# Altium project CALTRANS Signal Interface.PrjPcb
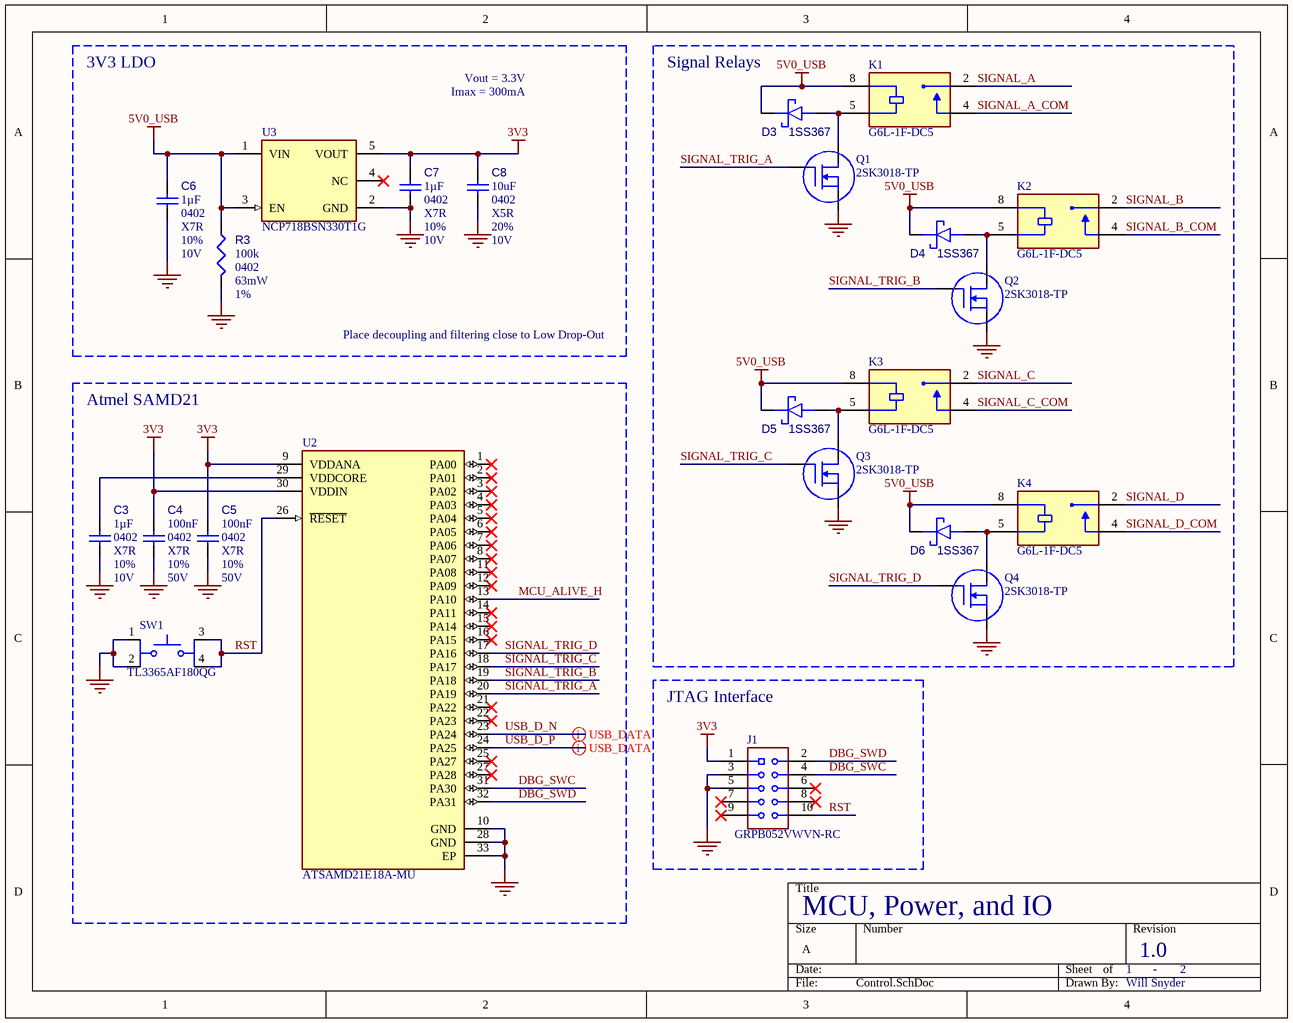
[diagram p0: Control.SchDoc]
2 sheets, 36 parts. Net scope: global (net labels, ports and power ports of the same name join across sheets).
Board file: CALTRANS Signal Interface.PcbDoc
Sheets:
  Control.SchDoc
  USB and LEDs.SchDoc

## Sheet Control.SchDoc
size A; Engineer: Will Snyder; Revision: 1.0; SheetNumber: 1; SheetTotal: 2; DocumentTItle: MCU, Power, and IO

### Parts
C3  value 1µF  Case/Package: 0402  Voltage Rating: 10V  Capacitor Type: X7R  Tolerance: 10%  [CAPC1005X55X30NL05T10]  (hidden comment: GRM155Z71A105KE01D)
C4  value 100nF  Voltage Rating: 50V  Capacitor Type: X7R  Case/Package: 0402  Tolerance: 10%  [CAPC1005X55X30NL05T10]  (hidden comment: 04025C104KAT4A)
C5  value 100nF  Voltage Rating: 50V  Capacitor Type: X7R  Case/Package: 0402  Tolerance: 10%  [CAPC1005X55X30NL05T10]  (hidden comment: 04025C104KAT4A)
C6  value 1µF  Case/Package: 0402  Voltage Rating: 10V  Capacitor Type: X7R  Tolerance: 10%  [CAPC1005X55X30NL05T10]  (hidden comment: GRM155Z71A105KE01D)
C7  value 1µF  Case/Package: 0402  Voltage Rating: 10V  Capacitor Type: X7R  Tolerance: 10%  [CAPC1005X55X30NL05T10]  (hidden comment: GRM155Z71A105KE01D)
C8  value 10uF  Capacitor Type: X5R  Voltage Rating: 10V  Tolerance: 20%  Case/Package: 0402  [CAPC1005X55X30NL05T10]  (hidden comment: GRM155R61A106ME11J)
D3  1SS367  [SOD2513X114N]
D4  1SS367  [SOD2513X114N]
D5  1SS367  [SOD2513X114N]
D6  1SS367  [SOD2513X114N]
J1  GRPB052VWVN-RC  [SULLINS_GRPB052VWVN-RC]
K1  G6L-1F-DC5  [RELAY_G6L-1F-DC5]
K2  G6L-1F-DC5  [RELAY_G6L-1F-DC5]
K3  G6L-1F-DC5  [RELAY_G6L-1F-DC5]
K4  G6L-1F-DC5  [RELAY_G6L-1F-DC5]
Q1  2SK3018-TP  [2SK3018-TP-Footprint-1]
Q2  2SK3018-TP  [2SK3018-TP-Footprint-1]
Q3  2SK3018-TP  [2SK3018-TP-Footprint-1]
Q4  2SK3018-TP  [2SK3018-TP-Footprint-1]
R3  value 100k  Power: 63mW  Case/Package: 0402  Tolerance: 1%  [RESC0402(1005)_L]  (hidden comment: 100KR2F)
SW1  TL3365AF180QG  [SW_TL3365AF180QG]
U2  ATSAMD21E18A-MU  [FP-PG-IPC_A]
U3  NCP718BSN330T1G  [SOT95P280X100-5N]

### Blocks framed on the sheet
3V3 LDO: C6-C8 R3 U3
Signal Relays: D3-D6 K1-K4 Q1-Q4
Atmel SAMD21: C3-C5 SW1 U2
JTAG Interface: J1

### Nets
3V3: C4.1 C5.1 C7.1 C8.1 J1.1 U2.9(VDDANA) U2.30(VDDIN) U3.5(VOUT)
5V0_USB: C6.1 D3.1(K) D4.1(K) D5.1(K) D6.1(K) K1.8(COIL1) K2.8(COIL1) K3.8(COIL1) K4.8(COIL1) R3.1 U3.1(VIN) U3.3(EN)
GND: C3.2 C4.2 C5.2 C6.2 C7.2 C8.2 J1.3 J1.5 Q1.2(S) Q2.2(S) Q3.2(S) Q4.2(S) R3.2 SW1.1 SW1.2 U2.10(GND) U2.28(GND) U2.33(EP) U3.2(GND)
DBG_SWC: J1.4 U2.31(PA30)
DBG_SWD: J1.2 U2.32(PA31)
MCU_ALIVE_H: U2.13(PA10)
RST: J1.10 SW1.3 SW1.4 U2.26(~{RESET})
SIGNAL_A: K1.2(COM)
SIGNAL_A_COM: K1.4(NO)
SIGNAL_B: K2.2(COM)
SIGNAL_B_COM: K2.4(NO)
SIGNAL_C: K3.2(COM)
SIGNAL_C_COM: K3.4(NO)
SIGNAL_D: K4.2(COM)
SIGNAL_D_COM: K4.4(NO)
SIGNAL_TRIG_A: Q1.1(G) U2.20(PA19)
SIGNAL_TRIG_B: Q2.1(G) U2.19(PA18)
SIGNAL_TRIG_C: Q3.1(G) U2.18(PA17)
SIGNAL_TRIG_D: Q4.1(G) U2.17(PA16)
USB_D_N: U2.23(PA24)
USB_D_P: U2.24(PA25)
NetC3_1: C3.1 U2.29(VDDCORE)
NetD3_2: D3.2(A) K1.5(COIL2) Q1.3(D)
NetD4_2: D4.2(A) K2.5(COIL2) Q2.3(D)
NetD5_2: D5.2(A) K3.5(COIL2) Q3.3(D)
NetD6_2: D6.2(A) K4.5(COIL2) Q4.3(D)

Not connected (* = marked no-connect by the designer): J1 6* 7* 8* 9*; U2 1(PA00)* 2(PA01)* 3(PA02)* 4(PA03)* 5(PA04)* 6(PA05)* 7(PA06)* 8(PA07)* 11(PA08)* 12(PA09)* 14(PA11)* 15(PA14)* 16(PA15)* 21(PA22)* 22(PA23)* 25(PA27)* 27(PA28)*; U3 4(NC)*

### Layout directives
differential pair: USB_D_N, USB_D_P

### Notes on the sheet
- Imax = 300mA
- Vout = 3.3V
- Place decoupling and filtering close to Low Drop-Out
- -

### Library data of the parts
C3 C6 C7 = CMP-001-00092-1: Ceramic Capacitor, Multilayer, Ceramic, 10V, 10% +Tol, 10% -Tol, X7R, 15% TC, 1uF, Surface Mount, 0402; Mounting Technology: Surface Mount; Max Operating Temperature: 125°C; Pins: 2; RoHS Compliant: Yes; Min Operating Temperature: -55°C
C4 C5 = CMP-001-00090-1: Ceramic Capacitor, Multilayer, Ceramic, 50V, 10% +Tol, 10% -Tol, X7R, 15% TC, 0.1uF, Surface Mount, 0402; Pins: 2; RoHS Compliant: Yes
C8 = CMP-001-00091-1: Ceramic Capacitor, Multilayer, Ceramic, 10V, 20% +Tol, 20% -Tol, X5R, 15% TC, 10uF, Surface Mount, 0402
D3-D6 = CMP-004-00052-1: Diode Schottky 10V 100mA USC; Forward Voltage: 500mV; Max Operating Temperature: 100°C; Min Operating Temperature: -40°C
J1 = CMP-002-00094-2: Connector Header Through Hole 10 position 0.050 (1.27mm); MF: Sullins; Price: None; Case/Package: None; SnapEDA_Link: https://www.snapeda.com/parts/GRPB052VWVN-RC/Sullins+Connector+Solutions/view-part/?ref=snap; MP: GRPB052VWVN-RC; Design Item ID: GRPB052VWVN-RC; Pins: 10; Value: *; Purchase-URL: https://pricing.snapeda.com/search/part/GRPB052VWVN-RC/?ref=eda; Source: GRPB052VWVN-RC.SchLib; Check_prices: https://www.snapeda.com/parts/GRPB052VWVN-RC/Sullins+Connector+Solutions/view-part/?ref=eda; Component Type: Standard; Availability: In Stock
K1-K4 = CMP-103-000000-1: Telecom Relay SPST-NO (1 Form A) Surface Mount; MP: G6L-1F-TR-DC5; MF: Omron Electronics; Component Type: Standard; Package: None; Value: *; Design Item ID: G6L-1F-DC5; Check_prices: https://www.snapeda.com/parts/G6L-1F-TR-DC5/Omron/view-part/?ref=eda; Pin Count: 4; SnapEDA_Link: https://www.snapeda.com/parts/G6L-1F-TR-DC5/Omron/view-part/?ref=snap; Source: G6L-1F-DC5.SchLib
Q1-Q4 = CMP-013-00044-1: Mosfet, N-Ch, 30V, 0.1A, Sot-323 Rohs Compliant: Yes
R3 = CMP-009-00064-2: 100K 0.063W 1% 0402 (1005 Metric)  SMD; Mounting Technology: SMT; Pins: 2
SW1 = CMP-011-00019-2: Tactile Switch SPST-NO Top Actuated Surface Mount; MF: E-Switch; MP: TL3365AF180QG; Case/Package: None; Availability: In Stock; SnapEDA_Link: https://www.snapeda.com/parts/TL3365AF180QG/E-Switch/view-part/?ref=snap; Check_prices: https://www.snapeda.com/parts/TL3365AF180QG/E-Switch/view-part/?ref=eda; Value: *; Pins: 4; Price: None; Purchase-URL: https://pricing.snapeda.com/search/part/TL3365AF180QG/?ref=eda; Component Type: Standard; Design Item ID: TL3365AF180QG; Source: TL3365AF180QG.SchLib
U2 = CMP-020-00023-1: RISC Microcontroller, 32-Bit, FLASH, CORTEX-M0 CPU, 48MHz, CMOS; Max Supply Voltage: 3.63V; Clock Frequency: 32MHz; Min Supply Voltage: 1.62V; Nominal Supply Voltage: 3.3V; RoHS Compliant: Yes; Max Operating Temperature: 85°C; Pins: 32; Case/Package: HVQCCN; Min Operating Temperature: -40°C
U3 = CMP-019-00058-1: Fixed Positive LDO Regulator, 3.3V, 440V Dropout, PDSO5; RoHS Compliant: Yes

## Sheet USB and LEDs.SchDoc
size A; Engineer: Will Snyder; Revision: 1.0; SheetNumber: 2; SheetTotal: 2; DocumentTitle: USB Type-C and LEDs
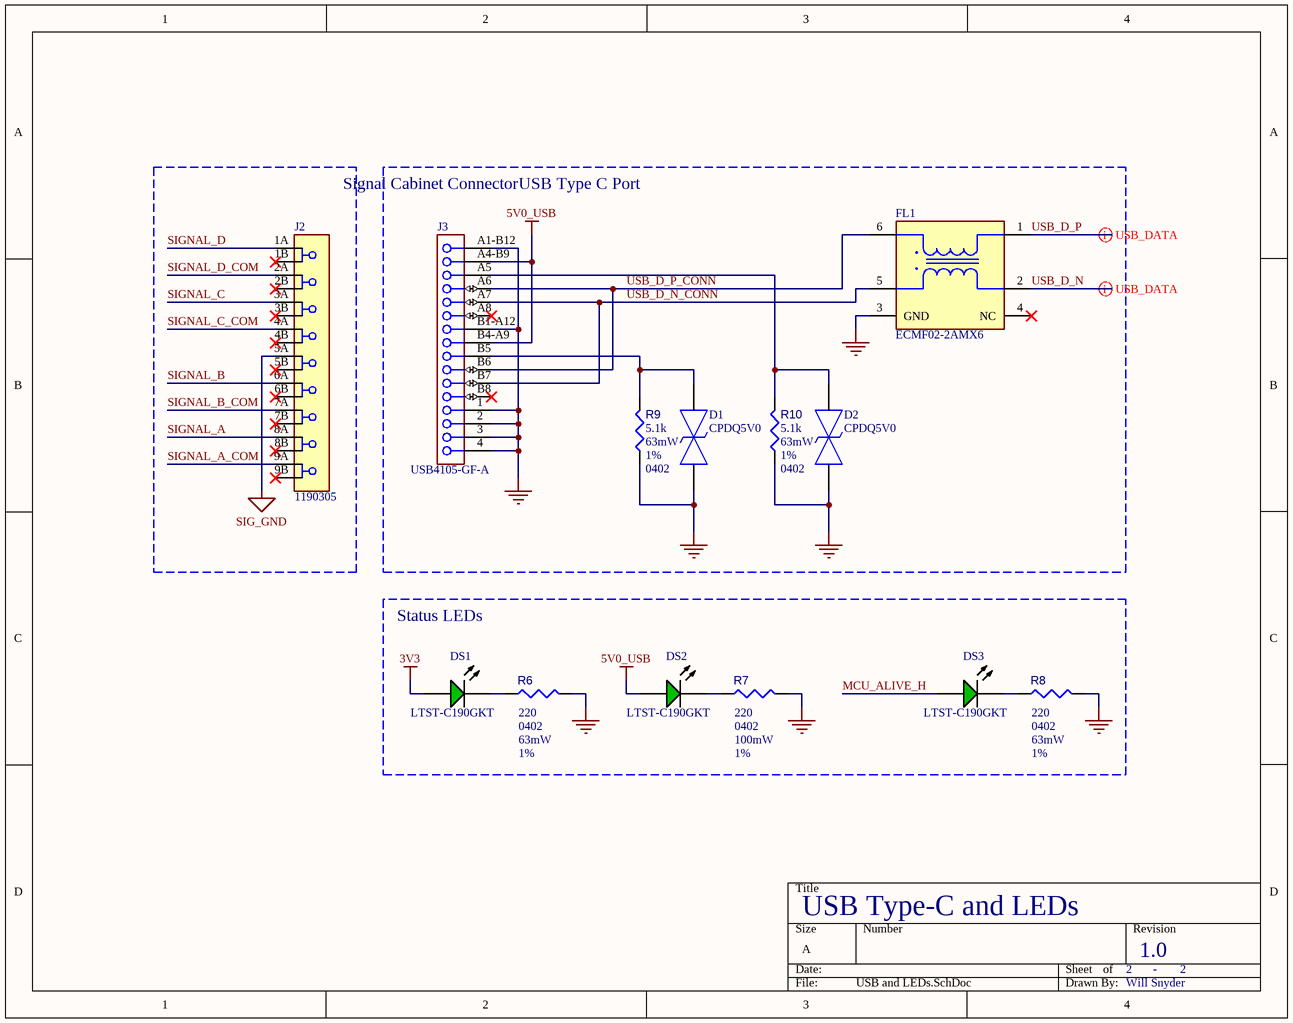
[diagram p1: USB and LEDs.SchDoc]

### Parts
D1  CPDQ5V0  [MBTB-D-SOD-923F-IMP-0402]
D2  CPDQ5V0  [MBTB-D-SOD-923F-IMP-0402]
DS1  LTST-C190GKT  [LTST-C190GKT_V]
DS2  LTST-C190GKT  [LTST-C190GKT_V]
DS3  LTST-C190GKT  [LTST-C190GKT_V]
FL1  ECMF02-2AMX6  [FP-QFN-6L-IPC_A]
J2  1190305  [PHOENIX_1190305]
J3  USB4105-GF-A  [FP-USB4105-GF-A-MFG]
R6  value 220  Tolerance: 1%  Power: 63mW  Case/Package: 0402  [RESC1005X40X25NL05T05]  (hidden comment: CRCW040259R0FKED)
R7  value 220  Case/Package: 0402  Tolerance: 1%  Power: 100mW  [RESC1005X40X25NL05T05]  (hidden comment: ERJ-2RKF1430X)
R8  value 220  Tolerance: 1%  Power: 63mW  Case/Package: 0402  [RESC1005X40X25NL05T05]  (hidden comment: CRCW040259R0FKED)
R9  value 5.1k  Power: 63mW  Tolerance: 1%  Case/Package: 0402  [RESC1005X40X25NL05T05]  (hidden comment: MCS04020C5101FE000)
R10  value 5.1k  Power: 63mW  Tolerance: 1%  Case/Package: 0402  [RESC1005X40X25NL05T05]  (hidden comment: MCS04020C5101FE000)

### Blocks framed on the sheet
Signal Cabinet Connector: J2
USB Type C Port: D1 D2 FL1 J3 R9 R10
Status LEDs: DS1-DS3 R6-R8

### Nets
3V3: DS1.1(A)
5V0_USB: DS2.1(A) J3.A4-B9(VBUS) J3.B4-A9(VBUS)
GND: D1.2(A) D2.2(A) FL1.3(GND) J3.1(MNT_1) J3.2(MNT_2) J3.3(MNT_3) J3.4(MNT_4) J3.A1-B12(GND) J3.B1-A12(GND) R6.2 R7.2 R8.2 R9.2 R10.2
SIG_GND: J2.5A
MCU_ALIVE_H: DS3.1(A)
SIGNAL_A: J2.8A
SIGNAL_A_COM: J2.9A
SIGNAL_B: J2.6A
SIGNAL_B_COM: J2.7A
SIGNAL_C: J2.3A
SIGNAL_C_COM: J2.4A
SIGNAL_D: J2.1A
SIGNAL_D_COM: J2.2A
USB_D_N: FL1.2(D-)
USB_D_N_CONN: FL1.5(D-) J3.A7(Dn1) J3.B7(Dn2)
USB_D_P: FL1.1(D+)
USB_D_P_CONN: FL1.6(D+) J3.A6(Dp1) J3.B6(Dp2)
NetD1_1: D1.1(K) J3.B5(CC2) R9.1
NetD2_1: D2.1(K) J3.A5(CC1) R10.1
NetDS1_2: DS1.2(K) R6.1
NetDS2_2: DS2.2(K) R7.1
NetDS3_2: DS3.2(K) R8.1

Not connected (* = marked no-connect by the designer): FL1 4(NC)*; J2 1B* 2B* 3B* 4B* 5B* 6B* 7B* 8B* 9B*; J3 A8(SBU1)* B8(SBU2)*

### Layout directives
differential pair: USB_D_N, USB_D_P

### Notes on the sheet
- -

### Library data of the parts
D1 D2 = CMP-004-00042-2: 18.6V Clamp 9.4A (8/20Âµs) Ipp Tvs Diode Surface Mount 0402/SOD-923F; MF: Comchip Technology; Design Item ID: CPDQ5V0-HF; SnapEDA_Link: https://www.snapeda.com/parts/CPDQ5V0-HF/Comchip%20Technology/view-part/809934/?ref=snap; Component Type: Standard; Purchase-URL: https://pricing.snapeda.com/search/part/CPDQ5V0-HF/?ref=eda; Pins: 2; Availability: Good; Source: CPDQ5V0-HF.SchLib; Case/Package: 0402 Comchip; Price: None; MP: CPDQ5V0-HF; Check_prices: https://www.snapeda.com/parts/CPDQ5V0-HF/Comchip%20Technology/view-part/809934/?ref=eda; Value: *
DS1-DS3 = CMP-007-00022-2: LED Uni-Color Green, 100 mW, 30 mA, -55 to 85 degC, 2-Pin SMD, RoHS, Tape and Reel; Manufacturer: Lite-On; Power: 100mW; Forward Voltage: 2.1V; Viewing Angle: 130degrees; Forward Current: 20mA; Luminous Intensity: 6mcd; Lens Style: Clear; Manufacturer URL: http://www.us.liteon.com/; RoHS Compliant: True; Colour: Green; Package Description: 2-Pin Surface Mount Device, Body 1.6 x 0.8 mm; Datasheet URL: http://datasheet.octopart.com/LTST-C190GKT-Lite-On-datasheet-158530.pdf; Datasheet Version: Dec-06; Mounting Technology: SM; Case/Package: 0603; Package Reference: C190GKT; Packaging: TapeandReel; Min Operating Temperature: -55°C; Nominal Vf: 2.1V; Package Quantity: 3000; Illumination Colour: Green; Max Operating Temperature: 85°C; Pins: 2
FL1 = CMP-00030-00005-1: Data Line Filter, 2 Function(s), 6 Pin(s), Plastic; Mounting Technology: Surface Mount; RoHS Compliant: Yes; Pins: 6; Min Operating Temperature: -40°C; Max Operating Temperature: 85°C
J2 = CMP-106-000000-2: LPT 2,5/ 9-5,0; MF: Phoenix Contact; Source: 1190305.SchLib; Pin Count: 18; Value: *; SnapEDA_Link: https://www.snapeda.com/parts/1190305/Phoenix+Contact/view-part/?ref=snap; Package: None; MP: 1190305; Design Item ID: 1190305; Check_prices: https://www.snapeda.com/parts/1190305/Phoenix+Contact/view-part/?ref=eda; Component Type: Standard
J3 = CMP-002-00095-3: Conn USB 2.0 Type C RCP 24 POS 0.3mm/0.5mm Solder RA SMD 24 Terminal 1 Port T/R
R6 R8 = CMP-009-00207-1: Fixed Resistor, Metal Glaze/thick Film, 0.063W, 59ohm, 50V, 1% +/-Tol, 100ppm/Cel, Surface Mount, 0402; Mounting Technology: Surface Mount; Max Operating Temperature: 155°C; RoHS Compliant: Yes; Min Operating Temperature: -55°C; Pins: 2
R7 = CMP-009-00208-1: Fixed Resistor, Metal Glaze/thick Film, 0.1W, 143ohm, 50V, 1% +/-Tol, 100ppm/Cel, Surface Mount, 0402; Mounting Technology: Surface Mount; RoHS Compliant: Yes; Min Operating Temperature: -55°C; Pins: 2; Max Operating Temperature: 155°C
R9 R10 = CMP-009-00205-1: Fixed Resistor, Thin Film, 0.063W, 5100ohm, 50V, 1% +/-Tol, 50ppm/Cel, Surface Mount, 0402; Min Operating Temperature: -55°C; Pins: 2; Max Operating Temperature: 125°C; Mounting Technology: Surface Mount; RoHS Compliant: Yes

## Nets that join several sheets
3V3: Control (8 pins), USB and LEDs (DS1.1)
5V0_USB: Control (12 pins), USB and LEDs (DS2.1 J3.A4-B9 J3.B4-A9)
GND: Control (19 pins), USB and LEDs (14 pins)
MCU_ALIVE_H: Control (U2.13), USB and LEDs (DS3.1)
SIGNAL_A: Control (K1.2), USB and LEDs (J2.8A)
SIGNAL_A_COM: Control (K1.4), USB and LEDs (J2.9A)
SIGNAL_B: Control (K2.2), USB and LEDs (J2.6A)
SIGNAL_B_COM: Control (K2.4), USB and LEDs (J2.7A)
SIGNAL_C: Control (K3.2), USB and LEDs (J2.3A)
SIGNAL_C_COM: Control (K3.4), USB and LEDs (J2.4A)
SIGNAL_D: Control (K4.2), USB and LEDs (J2.1A)
SIGNAL_D_COM: Control (K4.4), USB and LEDs (J2.2A)
USB_D_N: Control (U2.23), USB and LEDs (FL1.2)
USB_D_P: Control (U2.24), USB and LEDs (FL1.1)